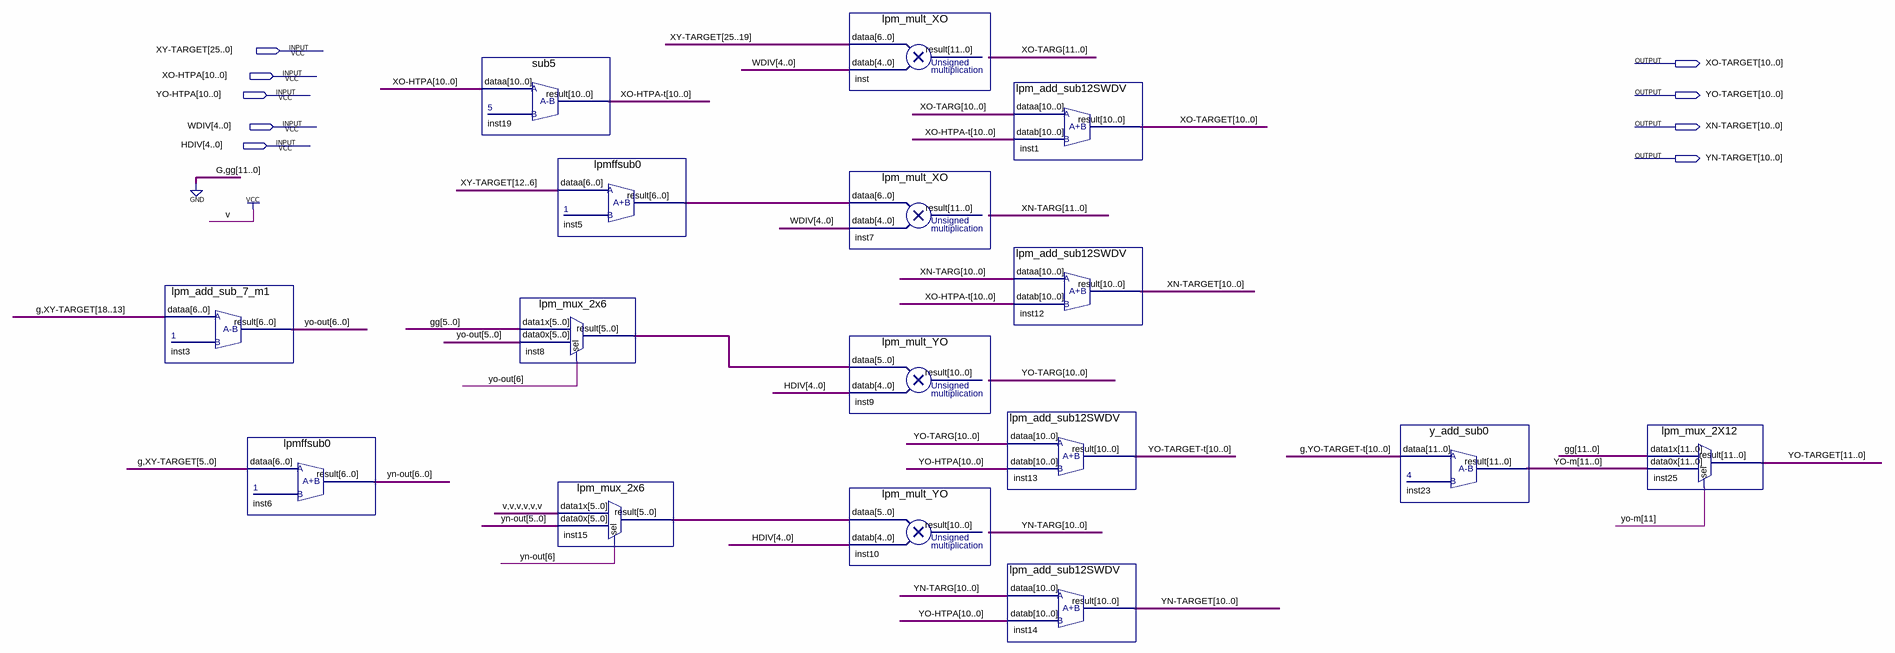
[diagram p0: schematic sheet]
// Quartus schematic XY-CONVERTER.bdf as structural Verilog: 16 symbols, 9 pins
module \XY-CONVERTER  (
  input  [25:0] \XY-TARGET ,
  input  [10:0] \XO-HTPA ,
  input  [10:0] \YO-HTPA ,
  input  [4:0] WDIV,
  input  [4:0] HDIV,
  output [10:0] \XO-TARGET ,
  output [11:0] \YO-TARGET ,
  output [10:0] \XN-TARGET ,
  output [10:0] \YN-TARGET 
);

  wire [5:0] inst8_result, inst15_result;
  wire [6:0] inst5_result, \yn-out , \yo-out ;
  wire [10:0] \XO-HTPA-t , \YN-TARG , \YO-TARG , \YO-TARGET-t ;
  wire [11:0] \XN-TARG , \XO-TARG , \yo-m ;

  lpm_add_sub_7_m1 inst3 (.dataa({1'b0, \XY-TARGET [18:13]}), .result(\yo-out ));
  lpmffsub0 inst6 (.dataa({1'b0, \XY-TARGET [5:0]}), .result(\yn-out ));
  sub5 inst19 (.dataa(\XO-HTPA ), .result(\XO-HTPA-t ));
  lpm_mux_2x6 inst8 (.data1x({6{1'b0}}), .data0x(\yo-out [5:0]), .sel(\yo-out [6]), .result(inst8_result));
  lpmffsub0 inst5 (.dataa(\XY-TARGET [12:6]), .result(inst5_result));
  lpm_mux_2x6 inst15 (.data1x({6{1'b1}}), .data0x(\yn-out [5:0]), .sel(\yn-out [6]), .result(inst15_result));
  lpm_mult_XO inst (.dataa(\XY-TARGET [25:19]), .datab(WDIV), .result(\XO-TARG ));
  lpm_mult_XO inst7 (.dataa(inst5_result), .datab(WDIV), .result(\XN-TARG ));
  lpm_mult_YO inst9 (.dataa(inst8_result), .datab(HDIV), .result(\YO-TARG ));
  lpm_mult_YO inst10 (.dataa(inst15_result), .datab(HDIV), .result(\YN-TARG ));
  lpm_add_sub12SWDV inst1 (.dataa(\XO-TARG [10:0]), .datab(\XO-HTPA-t ), .result(\XO-TARGET ));
  lpm_add_sub12SWDV inst12 (.dataa(\XN-TARG [10:0]), .datab(\XO-HTPA-t ), .result(\XN-TARGET ));
  lpm_add_sub12SWDV inst13 (.dataa(\YO-TARG ), .datab(\YO-HTPA ), .result(\YO-TARGET-t ));
  lpm_add_sub12SWDV inst14 (.dataa(\YN-TARG ), .datab(\YO-HTPA ), .result(\YN-TARGET ));
  y_add_sub0 inst23 (.dataa({1'b0, \YO-TARGET-t }), .result(\yo-m ));
  lpm_mux_2X12 inst25 (.data1x({12{1'b0}}), .data0x(\yo-m ), .sel(\yo-m [11]), .result(\YO-TARGET ));
endmodule
